# EasyEDA Pro project 1-12.eprj, schematic powermanagmen
Board Name: powermanagmen; Create Date: 2026-01-12; Page Name: powermanagmen; Project Name: 1-12; Schematic Name: powermanagmen; Update Date: 2026-01-19; File: powermanagmen; Id: /; Sheet: /
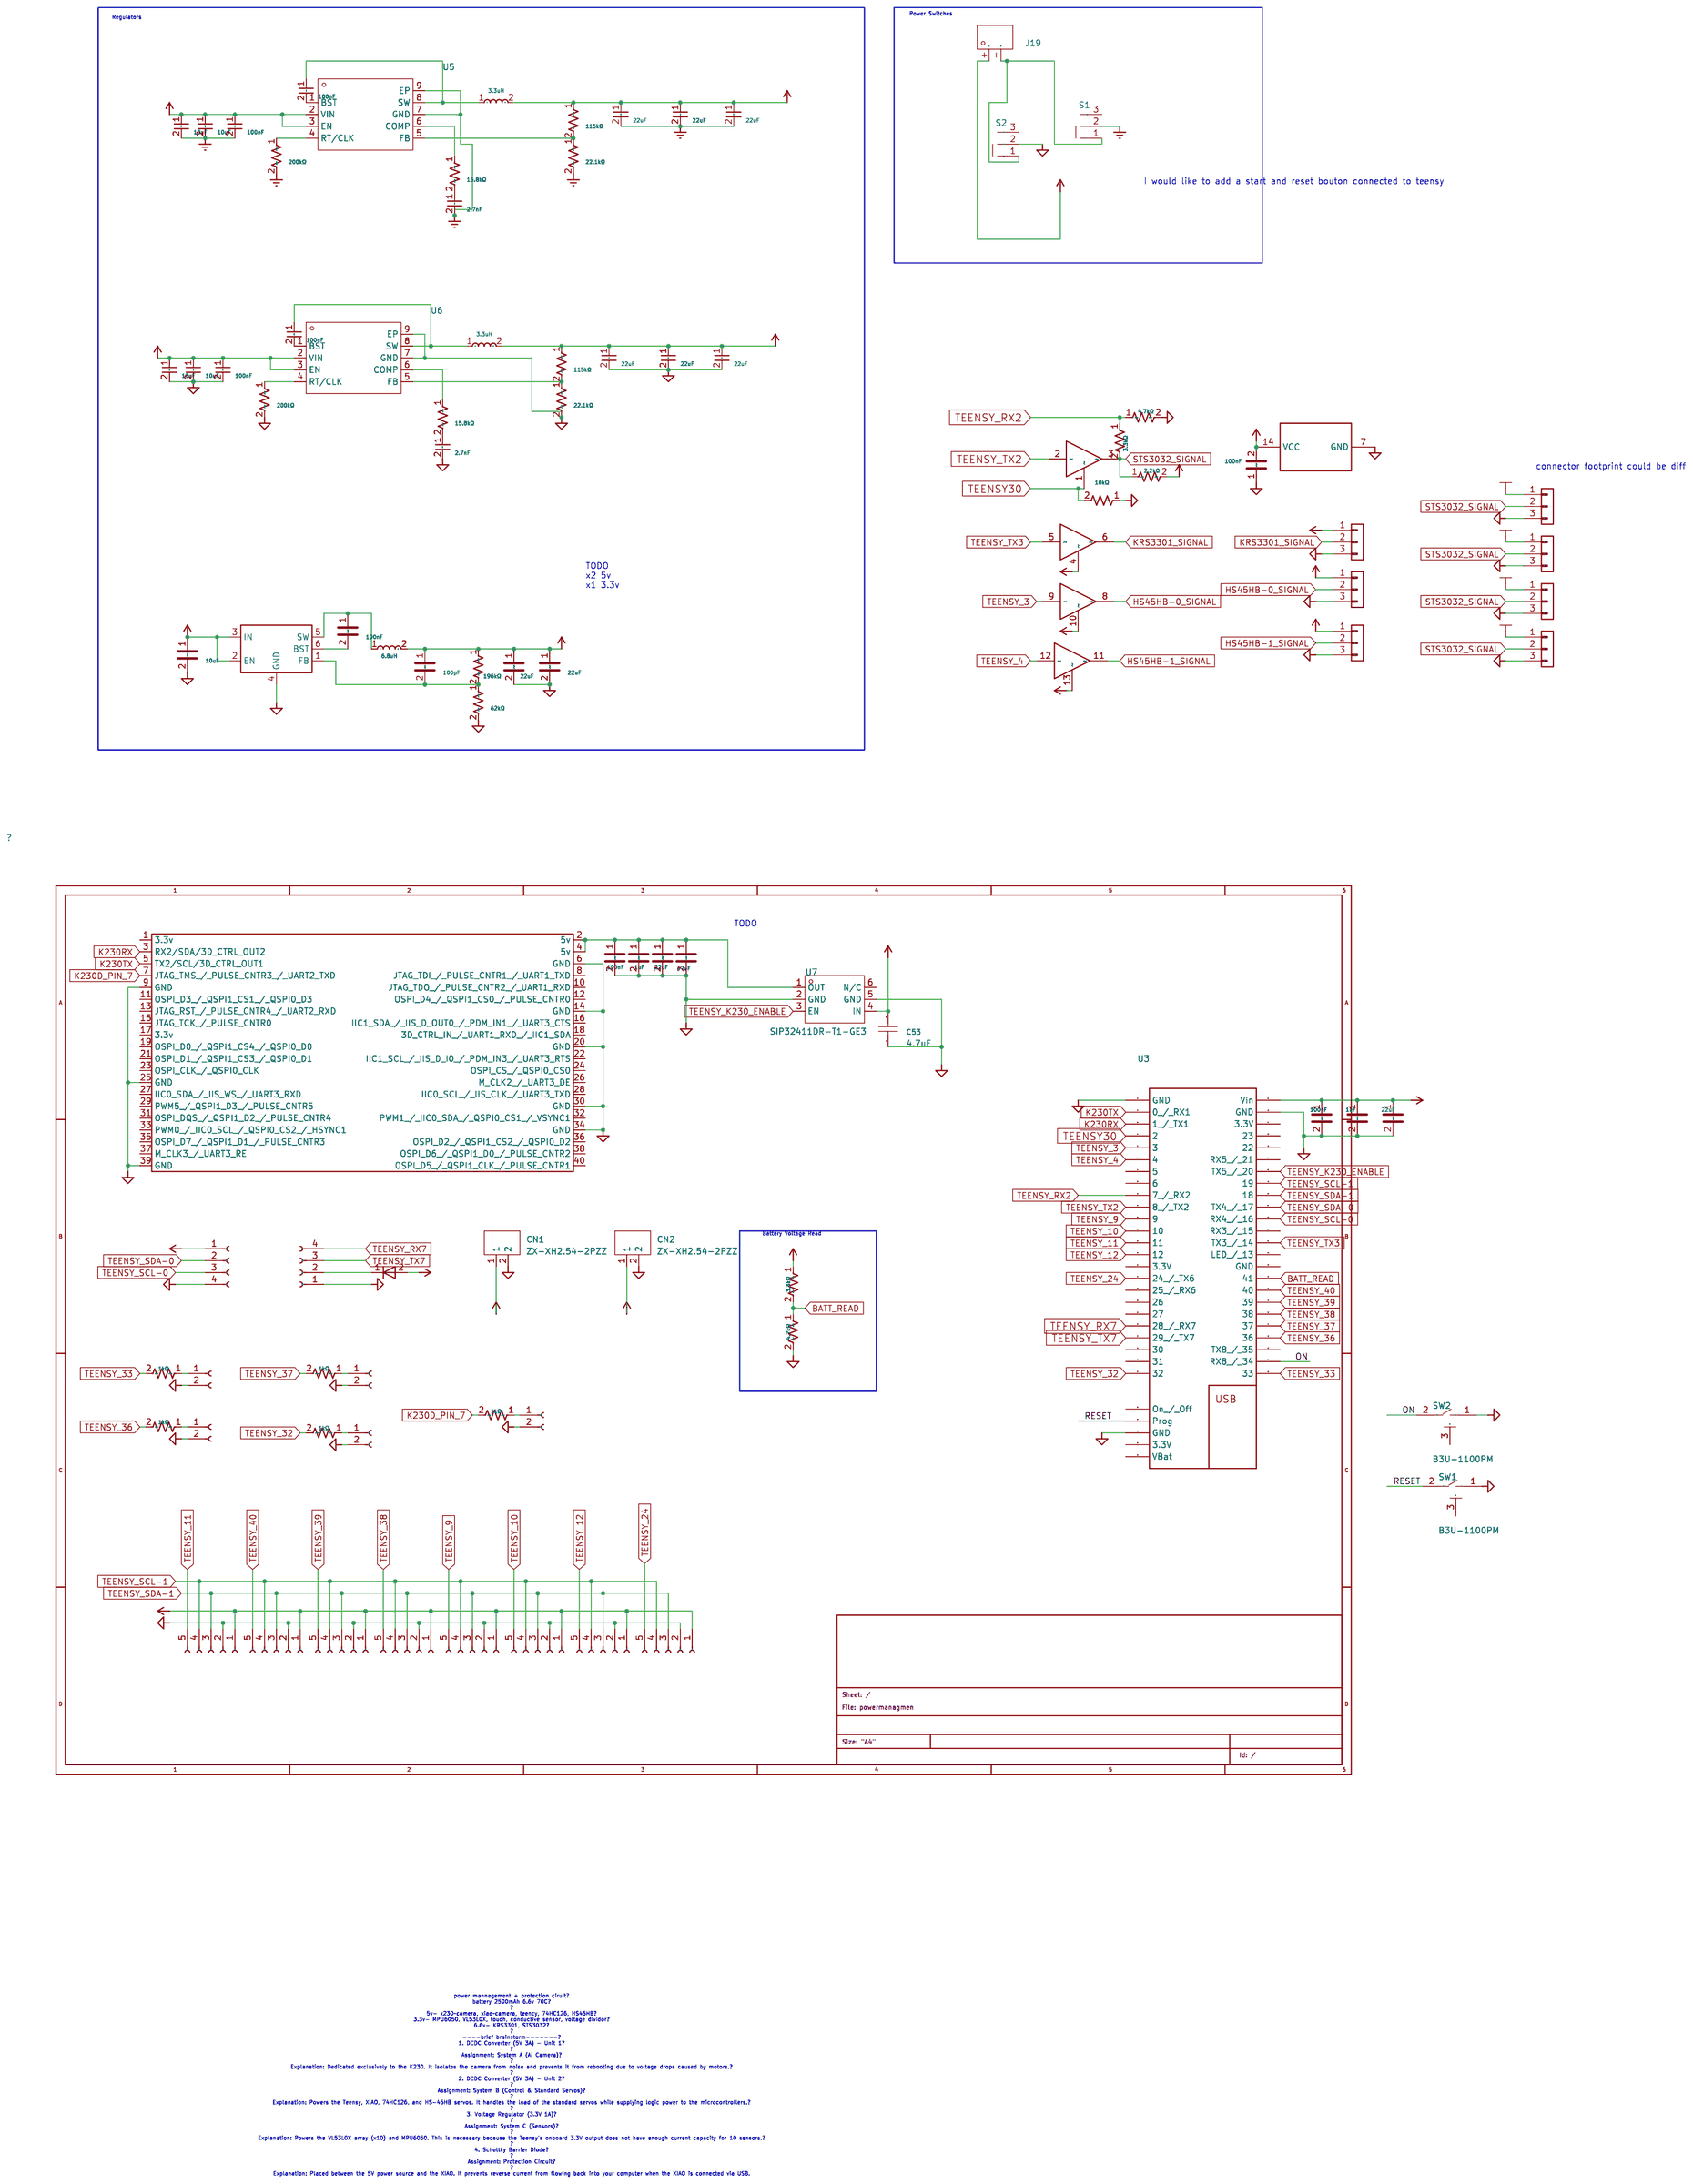
[diagram p0: schematic sheet]

## Parts
C1  100nF  [C0603]
C2  22uF  [C0603]
C3  1uF  [C0603]
C4  100nF  [C0603]
C5  10uF  [C0603]
C10  100pF  [C0603]
C17  100nF  [C0603]
C18  1uF  [C0603]
C19  22uF  [C0603]
C20  47uF  [C0603]
C21  22uF  [C0603]
C22  10uF  [C0603]
C23  100nF  [C0603]
C24  100nF  [C0603]
C29  22uF  [C0603]
C31  10uF  [C0603]
C40  100nF  [C0603]
C41  22uF  [C0603]
C42  22uF  [C0603]
C43  22uF  [C0603]
C44  2.7nF  [C0603]
C45  10uF  [C0603]
C46  10uF  [C0603]
C47  100nF  [C0603]
C48  100nF  [C0603]
C49  22uF  [C0603]
C50  22uF  [C0603]
C51  22uF  [C0603]
C52  2.7nF  [C0603]
C53  4.7uF  [C0603]
CN1  ZX-XH2.54-2PZZ  [CONN-TH_2P-P2.50_HX25003-2A]
CN2  ZX-XH2.54-2PZZ  [CONN-TH_2P-P2.50_HX25003-2A]
D3  BAT60B  [SOD-323_L1.7-W1.3-LS2.6-RD-1]
J1  B3B-XH-A(LF)(SN)  [CONN-TH_3P-P2.50_A2501WV2-3P]
J2  PZ254V-11-03P  [HDR-TH_3P-P2.54-V-M_PZ254V-11-03P]
J3  PZ254V-11-03P  [HDR-TH_3P-P2.54-V-M_PZ254V-11-03P]
J4  PZ254V-11-03P  [HDR-TH_3P-P2.54-V-M_PZ254V-11-03P]
J5  B4B-PH-K-S(LF)(SN)  [CONN-TH_B4B-PH-K-S]
J6  B2B-XH-A(LF)(SN)  [CONN-TH_B2B-XH-A-LF-SN]
J7  B2B-XH-A(LF)(SN)  [CONN-TH_B2B-XH-A-LF-SN]
J8  B2B-XH-A(LF)(SN)  [CONN-TH_B2B-XH-A-LF-SN]
J9  B2B-XH-A(LF)(SN)  [CONN-TH_B2B-XH-A-LF-SN]
J10  B2B-XH-A(LF)(SN)  [CONN-TH_B2B-XH-A-LF-SN]
J12  B3B-XH-A(LF)(SN)  [CONN-TH_3P-P2.50_A2501WV2-3P]
J13  B3B-XH-A(LF)(SN)  [CONN-TH_3P-P2.50_A2501WV2-3P]
J14  B3B-XH-A(LF)(SN)  [CONN-TH_3P-P2.50_A2501WV2-3P]
J18  B5B-PH-K-S(LF)(SN)  [CONN-TH_B5B-PH-K-S-LF-SN]
J19  XT60-F  [CONN-TH_XT60PB-F]
J25  B5B-PH-K-S(LF)(SN)  [CONN-TH_B5B-PH-K-S-LF-SN]
J26  B5B-PH-K-S(LF)(SN)  [CONN-TH_B5B-PH-K-S-LF-SN]
J27  B5B-PH-K-S(LF)(SN)  [CONN-TH_B5B-PH-K-S-LF-SN]
J28  B5B-PH-K-S(LF)(SN)  [CONN-TH_B5B-PH-K-S-LF-SN]
J29  B5B-PH-K-S(LF)(SN)  [CONN-TH_B5B-PH-K-S-LF-SN]
J32  B5B-PH-K-S(LF)(SN)  [CONN-TH_B5B-PH-K-S-LF-SN]
J33  B5B-PH-K-S(LF)(SN)  [CONN-TH_B5B-PH-K-S-LF-SN]
L3  6.8uH  [L0805]
L5  3.3uH  [IND-SMD_CYA0650-3.3UH]
L6  3.3uH  [IND-SMD_CYA0650-3.3UH]
R1  10kΩ  [R0603]
R4  1kΩ  [R0603]
R5  1kΩ  [R0603]
R6  1kΩ  [R0603]
R7  1kΩ  [R0603]
R8  1kΩ  [R0603]
R9  3.3kΩ  [R0603]
R10  4.7kΩ  [R0603]
R12  196kΩ  [R0603]
R15  62kΩ  [R0603]
R22  3.3kΩ  [R0603]
R23  4.7kΩ  [R0603]
R27  2.2kΩ  [R0603]
R28  115kΩ  [R0603]
R29  22.1kΩ  [R0603]
R30  15.8kΩ  [R0603]
R31  200kΩ  [R0603]
R32  200kΩ  [R0603]
R33  115kΩ  [R0603]
R34  22.1kΩ  [R0603]
R35  15.8kΩ  [R0603]
S1  SS-12M11G4  [SW-TH_XKB_SS-12M11XX]
S2  SS-12M11G4  [SW-TH_XKB_SS-12M11XX]
SW1  B3U-1100PM  [SW-SMD_3P-L3.0-W2.5-LS4.0]
SW2  B3U-1100PM  [SW-SMD_3P-L3.0-W2.5-LS4.0]
U1  CD74HCT126M96  [SOIC-14_L8.7-W3.9-P1.27-LS6.0-BL]  (sections 1,2,3,4,5)
U2  FH-00148  [HDR-SMD_40P-P2.54-V-F-R2-C20-S7.1-EH]
U3  TEENSY 4.1  [TEENSY 4.1]
U4  AP63201WU-7  [TSOT-23-6_L2.9-W1.6-P0.95-LS2.8-BR]
U5  AP64500SP-13  [SO-8_L4.9-W3.9-P1.27-LS6.0-BL-EP]
U6  AP64500SP-13  [SO-8_L4.9-W3.9-P1.27-LS6.0-BL-EP]
U7  SIP32411DR-T1-GE3  [SC-70-6_L2.1-W1.3-P0.65-LS2.1-BR]
XIAO  22035045  [CONN-TH_22035045]

## Library data of the parts
C1 C4 C17 C23 C24 C40 C47 C48 = TCC0603X7R104K500CT: Capacitance:100nF Tolerance:±10% Tolerance:±10% Voltage Rating:50V Temperature Coefficient:X7R; LCSC Part Name: 100nF ±10% 50V; Supplier Part: C282519; Manufacturer: CCTC(三环); Supplier Footprint: 0603; JLCPCB Part Class: Extended Part; Datasheet: https://item.szlcsc.com/datasheet/TCC0603X7R104K500CT/268639.html; Supplier: LCSC; Tolerance: ±10%; Voltage Rating: 50V; Temperature Coefficient: X7R
C2 C19 C21 C29 C41-C43 C49-C51 = CL10A226MP8NUNE: Capacitance:22uF Tolerance:±20% Tolerance:±20% Voltage Rating:10V Temperature Coefficient:X5R; LCSC Part Name: 22uF ±20% 10V; Supplier Part: C86295; Manufacturer: SAMSUNG(三星); Supplier Footprint: 0603; JLCPCB Part Class: Extended Part; Datasheet: https://item.szlcsc.com/datasheet/CL10A226MP8NUNE/87471.html; Supplier: LCSC; Tolerance: ±20%; Voltage Rating: 10V; Temperature Coefficient: X5R
C3 C18 = CL10A105KB8NNNC: Capacitance:1uF Tolerance:±10% Tolerance:±10% Voltage Rating:50V Temperature Coefficient:X5R; LCSC Part Name: 1uF ±10% 50V; Supplier Part: C15849; Manufacturer: SAMSUNG(三星); Supplier Footprint: 0603; JLCPCB Part Class: Basic Part; Datasheet: https://item.szlcsc.com/datasheet/CL10A105KB8NNNC/16531.html; Supplier: LCSC; Tolerance: ±10%; Voltage Rating: 50V; Temperature Coefficient: X5R
C5 C22 C31 C45 C46 = CL10A106MO8NQNC: Capacitance:10uF Tolerance:±20% Tolerance:±20% Voltage Rating:16V Temperature Coefficient:X5R; LCSC Part Name: 10uF ±20% 16V; Supplier Part: C92487; Manufacturer: SAMSUNG(三星); Supplier Footprint: 0603; JLCPCB Part Class: Extended Part; Datasheet: https://item.szlcsc.com/datasheet/CL10A106MO8NQNC/93680.html; Supplier: LCSC; Tolerance: ±20%; Voltage Rating: 16V; Temperature Coefficient: X5R
C10 = CL10C101JB8NNNC: Capacitance:100pF Tolerance:±5% Tolerance:±5% Voltage Rating:50V Temperature Coefficient:C0G; LCSC Part Name: 100pF ±5% 50V; Supplier Part: C14858; Manufacturer: SAMSUNG(三星); Supplier Footprint: 0603; JLCPCB Part Class: Basic Part; Datasheet: https://item.szlcsc.com/datasheet/CL10C101JB8NNNC/15530.html; Supplier: LCSC; Tolerance: ±5%; Voltage Rating: 50V; Temperature Coefficient: C0G
C20 = GRM188R60J476ME15D: Capacitance:47uF Tolerance:±20% Tolerance:±20% Voltage Rating:6.3V Temperature Coefficient:X5R; LCSC Part Name: 47uF ±20% 6.3V; Supplier Part: C140782; Manufacturer: muRata(村田); Supplier Footprint: 0603; JLCPCB Part Class: Extended Part; Datasheet: https://item.szlcsc.com/datasheet/GRM188R60J476ME15D/152108.html; Supplier: LCSC; Tolerance: ±20%; Voltage Rating: 6.3V; Temperature Coefficient: X5R
C44 C52 = GRM1885C1H272JA01D: Capacitance:2.7nF Tolerance:±5% Tolerance:±5% Voltage Rating:50V Temperature Coefficient:C0G; LCSC Part Name: 2.7nF ±5% 50V; Supplier Part: C77034; Manufacturer: muRata(村田); Supplier Footprint: 0603; JLCPCB Part Class: Extended Part; Datasheet: https://item.szlcsc.com/datasheet/GRM1885C1H272JA01D/78161.html; Supplier: LCSC; Tolerance: ±5%; Voltage Rating: 50V; Temperature Coefficient: C0G
C53 = CL10A475KP8NNNC: LCSC Part Name: 4.7uF ±10% 10V; Supplier Part: C1705; Manufacturer: SAMSUNG(三星); Supplier Footprint: 0603; JLCPCB Part Class: Extended Part; Datasheet: https://item.szlcsc.com/datasheet/CL10A475KP8NNNC/2057.html; Supplier: LCSC; Tolerance: ±10%; Voltage Rating: 10V; Temperature Coefficient: X5R
CN1 CN2 = ZX-XH2.54-2PZZ: Pins Structure:1x2P Pitch:2.5mm Mounting Type:Through Hole Reference Series:XH Number of Pins:2P Number of Rows:1 Number of PINs Per Row:2 Row Spacing:- Current Rating:2A Contact Material:Brass Contact Plating:Tin Operating Temperature:-25℃~+85℃ Operating; LCSC Part Name: 1x2P 间距:2.5mm 直插 系列:XH; Supplier Part: C7429632; Manufacturer: Megastar(兆星); Supplier Footprint: 插件,P=2.5mm; JLCPCB Part Class: Extended Part; Datasheet: https://item.szlcsc.com/datasheet/ZX-XH2.54-2PZZ/8427549.html; Supplier: LCSC; Pins Structure: 1x2P; Pitch: 2.5mm; Mounting Type: Through Hole; Reference Series: XH; Number of Pins: 2P; Number of Rows: 1; Number of PINs Per Row: 2; Current Rating: 2A; Contact Material: Brass; Contact Plating: Tin; Operating Temperature: -25℃~+85℃; Voltage Rating: 250V; Plastic Material: PA66; Flame Retardant Rating: UL94V-0; Color: White; Z-Height of the Board: 7mm; X-Length of Bottom Edge on Board (Spacing Line): 7.5mm; Y-Width of Bottom Edge on Board: 5.9mm
D3 = BAT60B_C7502695: Diode Configuration:Independent Voltage - Forward(Vf@If):600mV@1A Voltage - DC Reverse(Vr):10V Current - Rectified:3A Reverse Leakage Current (Ir):25uA Non-Repetitive Peak Forward Surge Current:5A; LCSC Part Name: 电压:10V 电流:3A; Supplier Part: C7502695; Manufacturer: R+O(宏嘉诚); Supplier Footprint: SOD-323; JLCPCB Part Class: Extended Part; Datasheet: https://item.szlcsc.com/datasheet/BAT60B/8589412.html; Supplier: LCSC; Diode Configuration: Independent; Voltage - Forward(Vf@If): 600mV@1A; Voltage - DC Reverse(Vr): 10V; Current - Rectified: 3A; Reverse Leakage Current (Ir): 25uA; Non-Repetitive Peak Forward Surge Current: 5A
J1 J12-J14 = B3B-XH-A(LF)(SN): Pins Structure:1x3P Pitch:2.5mm Mounting Type:Through Hole Reference Series:XH Number of Pins:3P Number of Rows:1 Number of PINs Per Row:3 Row Spacing:- Current Rating:3A Contact Material:Brass Contact Plating:Tin Operating Temperature:-25℃~+85℃ Operating; LCSC Part Name: 1x3P 间距:2.5mm 直插 系列:XH; Supplier Part: C144394; Manufacturer: JST; Supplier Footprint: 插件,P=2.5mm; JLCPCB Part Class: Extended Part; Datasheet: https://item.szlcsc.com/datasheet/B3B-XH-A(LF)(SN)/155726.html; Supplier: LCSC; Pins Structure: 1x3P; Pitch: 2.5mm; Mounting Type: Through Hole; Reference Series: XH; Number of Pins: 3P; Number of Rows: 1; Number of PINs Per Row: 3; Current Rating: 3A; Contact Material: Brass; Contact Plating: Tin; Operating Temperature: -25℃~+85℃; Voltage Rating: 250V; Plastic Material: PA66; Flame Retardant Rating: UL94V-0; Supplementary Features: K Pin; Color: White; Z-Height of the Board: 7mm; X-Length of Bottom Edge on Board (Spacing Line): 9.9mm; Y-Width of Bottom Edge on Board: 5.75mm
J2-J4 = PZ254V-11-03P: Pin Structure:1x3P Pitch:2.54mm Row Spacing:- Circluar Pins/Square Pins:Pin Header Mounting Type:Through Hole Number of Rows:1 Number of Pins:3P Current Rating:3A Voltage Rating (Max):250V Length of Mating Pin:6mm Insulation Height:2.5mm Length of End Con; LCSC Part Name: 1x3P 间距:2.54mm 方针 直插; Supplier Part: C2937625; Manufacturer: XFCN(兴飞); Supplier Footprint: 插件,P=2.54mm; JLCPCB Part Class: Extended Part; Datasheet: https://item.szlcsc.com/datasheet/PZ254V-11-03P/3293280.html; Supplier: LCSC; Pin Structure: 1x3P; Pitch: 2.54mm; Circluar Pins/Square Pins: Pin Header; Mounting Type: Through Hole; Number of Rows: 1; Number of Pins: 3P; Current Rating: 3A; Voltage Rating (Max): 250V; Length of Mating Pin: 6mm; Insulation Height: 2.5mm; Length of End Connection Pin: 3mm; Operating Temperature: -40℃~+105℃; Color: Black
J5 = B4B-PH-K-S(LF)(SN)_C131334: Pins Structure:1x4P Pitch:2mm Mounting Type:Through Hole Reference Series:PH Number of Pins:4P Number of Rows:1 Number of PINs Per Row:4 Row Spacing:- Current Rating:2A Contact Material:Brass Contact Plating:Tin Operating Temperature:-25℃~+85℃ Operating T; LCSC Part Name: 1x4P 间距:2mm 直插 系列:PH; Supplier Part: C131334; Manufacturer: JST; Supplier Footprint: 插件,P=2mm; JLCPCB Part Class: Extended Part; Datasheet: https://item.szlcsc.com/datasheet/B4B-PH-K-S(LF)(SN)/142627.html; Supplier: LCSC; Pins Structure: 1x4P; Pitch: 2mm; Mounting Type: Through Hole; Reference Series: PH; Number of Pins: 4P; Number of Rows: 1; Number of PINs Per Row: 4; Current Rating: 2A; Contact Material: Brass; Contact Plating: Tin; Operating Temperature: -25℃~+85℃; Voltage Rating: 100V; Plastic Material: PA66; Flame Retardant Rating: UL94V-0; Supplementary Features: K Pin; Color: White; Z-Height of the Board: 6mm; X-Length of Bottom Edge on Board (Spacing Line): 9.9mm; Y-Width of Bottom Edge on Board: 4.5mm
J6-J10 = B2B-XH-A(LF)(SN): Pins Structure:1x2P Pitch:2.5mm Mounting Type:Through Hole Reference Series:XH Number of Pins:2P Number of Rows:1 Number of PINs Per Row:2 Row Spacing:- Current Rating:3A Contact Material:Brass Contact Plating:Tin Operating Temperature:-25℃~+85℃ Operating; LCSC Part Name: 1x2P 间距:2.5mm 直插 系列:XH; Supplier Part: C158012; Manufacturer: JST; Supplier Footprint: 插件,P=2.5mm; JLCPCB Part Class: Extended Part; Datasheet: https://item.szlcsc.com/datasheet/B2B-XH-A(LF)(SN)/169360.html; Supplier: LCSC; Pins Structure: 1x2P; Pitch: 2.5mm; Mounting Type: Through Hole; Reference Series: XH; Number of Pins: 2P; Number of Rows: 1; Number of PINs Per Row: 2; Current Rating: 3A; Contact Material: Brass; Contact Plating: Tin; Operating Temperature: -25℃~+85℃; Voltage Rating: 250V; Plastic Material: PA66; Flame Retardant Rating: UL94V-0; Supplementary Features: K Pin; Color: White; Z-Height of the Board: 7mm; X-Length of Bottom Edge on Board (Spacing Line): 7.4mm; Y-Width of Bottom Edge on Board: 5.75mm
J18 J25-J29 J32 J33 = B5B-PH-K-S(LF)(SN): Pins Structure:1x5P Pitch:2mm Mounting Type:Through Hole Reference Series:PH Number of Pins:5P Number of Rows:1 Number of PINs Per Row:5 Row Spacing:- Current Rating:2A Contact Material:Brass Contact Plating:Tin Operating Temperature:-25℃~+85℃ Operating T; LCSC Part Name: 1x5P 间距:2mm 直插 系列:PH; Supplier Part: C157993; Manufacturer: JST; Supplier Footprint: 插件,P=2mm; JLCPCB Part Class: Extended Part; Datasheet: https://item.szlcsc.com/datasheet/B5B-PH-K-S(LF)(SN)/169341.html; Supplier: LCSC; Pins Structure: 1x5P; Pitch: 2mm; Mounting Type: Through Hole; Reference Series: PH; Number of Pins: 5P; Number of Rows: 1; Number of PINs Per Row: 5; Current Rating: 2A; Contact Material: Brass; Contact Plating: Tin; Operating Temperature: -25℃~+85℃; Voltage Rating: 100V; Plastic Material: PA66; Flame Retardant Rating: UL94V-0; Supplementary Features: K Pin; Color: White; Z-Height of the Board: 6mm; X-Length of Bottom Edge on Board (Spacing Line): 11.9mm; Y-Width of Bottom Edge on Board: 4.5mm
J19 = XT60-F: Power:- Output:- Input:- Size:- Interface:- Type:- Colour:Yellow MaximumCurrent:- Type:Banana Connector RatedVoltage:- Type1:- NumberOfUSBHoles:- InterfaceType:Female MetalMaterial:Gold Plated InsulationMaterial:- RatedCurrent:- RecommendedWireGauge:- Fla; LCSC Part Name: AMASS(艾迈斯)XT60模型插头 3.5mm镀金香蕉头母头 XT60-F; Supplier Part: C98734; Manufacturer: AMASS(艾迈斯); JLCPCB Part Class: Extended Part; Datasheet: https://item.szlcsc.com/datasheet/XT60-F/99944.html; Supplier: LCSC; Type: Banana Connector; Colour: Yellow; InterfaceType: Female; MetalMaterial: Gold Plated
L3 = MGFL2012F6R8MT-LF: Inductance:6.8uH Tolerance:±20% Tolerance:±20% Current Rating:550mA Current - Saturation (Isat):- DC Resistance(DCR):270mΩ Q @ Frequency:- Frequency - Self Resonant:- Ratings:-; LCSC Part Name: 6.8uH ±20%; Supplier Part: C486332; Manufacturer: microgate(麦捷科技); Supplier Footprint: 0805; JLCPCB Part Class: Extended Part; Datasheet: https://item.szlcsc.com/datasheet/MGFL2012F6R8MT-LF/494805.html; Supplier: LCSC; Tolerance: ±20%; Current Rating: 550mA; DC Resistance(DCR): 270mΩ
L5 L6 = CYA0650-3.3UH: Inductance: Tolerance:±20% Tolerance:±20% Current Rating: DC Resistance(DCR):19.9mΩ; LCSC Part Name: 3.3uH ±20%; Supplier Part: C5189753; Manufacturer: SHOU HAN(首韩); Supplier Footprint: SMD,7.2x6.6mm; JLCPCB Part Class: Extended Part; Datasheet: https://atta.szlcsc.com/upload/public/pdf/source/20250110/D8E5DDB17316764D39629F3242DE5FE2.pdf; Supplier: LCSC; Tolerance: ±20%; DC Resistance(DCR): 19.9mΩ
R1 = 0603WAF1002T5E: Type:Thick Film Resistor Resistance:10kΩ Tolerance:±1% Tolerance:±1% Power(Watts):100mW Voltage-Supply(Max):75V Temperature Coefficient:±100ppm/℃ Temperature Coefficient:±100ppm/℃ Operating Temperature:-55℃~+155℃ Operating Temperature:-55℃~+155℃; LCSC Part Name: 厚膜电阻 10kΩ ±1% 100mW; Supplier Part: C25804; Manufacturer: UNI-ROYAL(厚声); Supplier Footprint: 0603; JLCPCB Part Class: Basic Part; Datasheet: https://item.szlcsc.com/datasheet/0603WAF1002T5E/26547.html; Supplier: LCSC; Type: Thick Film Resistor; Tolerance: ±1%; Power(Watts): 100mW; Voltage-Supply(Max): 75V; Temperature Coefficient: ±100ppm/℃; Operating Temperature: -55℃~+155℃
R4-R7 = 0603WAF4700T5E: Type:Thick Film Resistor Resistance:470Ω Tolerance:±1% Tolerance:±1% Power(Watts):100mW Voltage-Supply(Max):75V Temperature Coefficient:±100ppm/℃ Temperature Coefficient:±100ppm/℃ Operating Temperature:-55℃~+155℃ Operating Temperature:-55℃~+155℃; LCSC Part Name: 470Ω ±1% 100mW 厚膜电阻; Supplier Part: C23179; Manufacturer: UNI-ROYAL(厚声); Supplier Footprint: 0603; JLCPCB Part Class: Basic Part; Datasheet: https://item.szlcsc.com/datasheet/0603WAF4700T5E/23906.html; Supplier: LCSC; Type: Thick Film Resistor; Tolerance: ±1%; Power(Watts): 100mW; Voltage-Supply(Max): 75V; Temperature Coefficient: ±100ppm/℃; Operating Temperature: -55℃~+155℃
R8 = 0603WAF1001T5E: Type:Thick Film Resistor Resistance:1kΩ Tolerance:±1% Tolerance:±1% Power(Watts):100mW Voltage-Supply(Max):75V Temperature Coefficient:±100ppm/℃ Temperature Coefficient:±100ppm/℃ Operating Temperature:-55℃~+155℃ Operating Temperature:-55℃~+155℃; LCSC Part Name: 1kΩ ±1% 100mW 厚膜电阻; Supplier Part: C21190; Manufacturer: UNI-ROYAL(厚声); Supplier Footprint: 0603; JLCPCB Part Class: Basic Part; Datasheet: https://item.szlcsc.com/datasheet/0603WAF1001T5E/21904.html; Supplier: LCSC; Type: Thick Film Resistor; Tolerance: ±1%; Power(Watts): 100mW; Voltage-Supply(Max): 75V; Temperature Coefficient: ±100ppm/℃; Operating Temperature: -55℃~+155℃
R9 R10 R27 = 0603WAF2201T5E_C4190: Type:Thick Film Resistors Resistance:2.2kΩ Tolerance:±1% Tolerance:±1% Power(Watts): Overload Voltage (Max): Temperature Coefficient:±100ppm/℃ Temperature Coefficient:±100ppm/℃ Operating Temperature Range:-55℃~+155℃ Operating Temperature Range:-55℃~+155℃; LCSC Part Name: 2.2kΩ ±1% 100mW 厚膜电阻; Supplier Part: C4190; Manufacturer: UNI-ROYAL(厚声); Manufacturer Part: 0603WAF2201T5E; Supplier Footprint: 0603; JLCPCB Part Class: Basic Part; Datasheet: https://atta.szlcsc.com/upload/public/pdf/source/20200306/C422600_1E6D84923E4A46A82E41ADD87F860B5C.pdf; Supplier: LCSC; Type: Thick Film Resistors; Tolerance: ±1%; Temperature Coefficient: ±100ppm/℃; Operating Temperature Range: -55℃~+155℃
R12 = FRC0603F1963TS: Type:Thick Film Resistor Resistance:196kΩ Tolerance:±1% Tolerance:±1% Power(Watts):100mW Voltage-Supply(Max):75V Temperature Coefficient:±100ppm/℃ Temperature Coefficient:±100ppm/℃ Operating Temperature:-55℃~+155℃ Operating Temperature:-55℃~+155℃; LCSC Part Name: 196kΩ ±1% 100mW 厚膜电阻; Supplier Part: C2974032; Manufacturer: FOJAN(富捷); Supplier Footprint: 0603; JLCPCB Part Class: Extended Part; Supplier: LCSC; Type: Thick Film Resistor; Tolerance: ±1%; Power(Watts): 100mW; Voltage-Supply(Max): 75V; Temperature Coefficient: ±100ppm/℃; Operating Temperature: -55℃~+155℃
R15 = FRC0603F6202TS: Type:Thick Film Resistor Resistance:62kΩ Tolerance:±1% Tolerance:±1% Power(Watts):100mW Voltage-Supply(Max):75V Temperature Coefficient:±100ppm/℃ Temperature Coefficient:±100ppm/℃ Operating Temperature:-55℃~+155℃ Operating Temperature:-55℃~+155℃; LCSC Part Name: 62kΩ ±1% 100mW 厚膜电阻; Supplier Part: C2907059; Manufacturer: FOJAN(富捷); Supplier Footprint: 0603; JLCPCB Part Class: Extended Part; Supplier: LCSC; Type: Thick Film Resistor; Tolerance: ±1%; Power(Watts): 100mW; Voltage-Supply(Max): 75V; Temperature Coefficient: ±100ppm/℃; Operating Temperature: -55℃~+155℃
R22 = ARG03FTC8002N: Type:Thin Film Resistor Resistance:80kΩ Tolerance:±1% Tolerance:±1% Power(Watts):100mW Voltage-Supply(Max):75V Temperature Coefficient:±25ppm/℃ Temperature Coefficient:±25ppm/℃ Operating Temperature:-55℃~+155℃ Operating Temperature:-55℃~+155℃; LCSC Part Name: 薄膜电阻 80kΩ ±1% 100mW 停产; Supplier Part: C3014409; Manufacturer: Viking(光颉); Supplier Footprint: 0603; JLCPCB Part Class: Extended Part; Datasheet: https://item.szlcsc.com/datasheet/ARG03FTC8002N/3525166.html; Supplier: LCSC; Type: Thin Film Resistor; Tolerance: ±1%; Power(Watts): 100mW; Voltage-Supply(Max): 75V; Temperature Coefficient: ±25ppm/℃; Operating Temperature: -55℃~+155℃
R23 = FRC0603F2002TS: Type:Thick Film Resistor Resistance:20kΩ Tolerance:±1% Tolerance:±1% Power(Watts):100mW Voltage-Supply(Max):75V Temperature Coefficient:±100ppm/℃ Temperature Coefficient:±100ppm/℃ Operating Temperature:-55℃~+155℃ Operating Temperature:-55℃~+155℃; LCSC Part Name: 20kΩ ±1% 100mW 厚膜电阻; Supplier Part: C2907011; Manufacturer: FOJAN(富捷); Supplier Footprint: 0603; JLCPCB Part Class: Extended Part; Supplier: LCSC; Type: Thick Film Resistor; Tolerance: ±1%; Power(Watts): 100mW; Voltage-Supply(Max): 75V; Temperature Coefficient: ±100ppm/℃; Operating Temperature: -55℃~+155℃
R28 R33 = 0603WAF1153T5E: Type:Thick Film Resistor Resistance:115kΩ Tolerance:±1% Tolerance:±1% Power(Watts):100mW Voltage-Supply(Max):75V Temperature Coefficient:±100ppm/℃ Temperature Coefficient:±100ppm/℃ Operating Temperature:-55℃~+155℃ Operating Temperature:-55℃~+155℃; LCSC Part Name: 115kΩ ±1% 100mW 厚膜电阻; Supplier Part: C22783; Manufacturer: UNI-ROYAL(厚声); Supplier Footprint: 0603; JLCPCB Part Class: Extended Part; Datasheet: https://item.szlcsc.com/datasheet/0603WAF1153T5E/23510.html; Supplier: LCSC; Type: Thick Film Resistor; Tolerance: ±1%; Power(Watts): 100mW; Voltage-Supply(Max): 75V; Temperature Coefficient: ±100ppm/℃; Operating Temperature: -55℃~+155℃
R29 R34 = 0603WAF2212T5E: LCSC Part Name: 22.1kΩ ±1% 100mW 厚膜电阻; Supplier Part: C25961; Manufacturer: UNI-ROYAL(厚声); Supplier Footprint: 0603; JLCPCB Part Class: Extended Part; Datasheet: https://atta.szlcsc.com/upload/public/pdf/source/20200306/C422600_1E6D84923E4A46A82E41ADD87F860B5C.pdf; Supplier: LCSC; Type: Thick Film Resistors; Tolerance: ±1%; Temperature Coefficient: ±100ppm/℃; Operating Temperature Range: -55℃~+155℃
R30 R35 = FRC0603F1582TS: Type:Thick Film Resistor Resistance:15.8kΩ Tolerance:±1% Tolerance:±1% Power(Watts):100mW Voltage-Supply(Max):75V Temperature Coefficient:±100ppm/℃ Temperature Coefficient:±100ppm/℃ Operating Temperature:-55℃~+155℃ Operating Temperature:-55℃~+155℃; LCSC Part Name: 15.8kΩ ±1% 100mW 厚膜电阻; Supplier Part: C2960716; Manufacturer: FOJAN(富捷); Supplier Footprint: 0603; JLCPCB Part Class: Extended Part; Supplier: LCSC; Type: Thick Film Resistor; Tolerance: ±1%; Power(Watts): 100mW; Voltage-Supply(Max): 75V; Temperature Coefficient: ±100ppm/℃; Operating Temperature: -55℃~+155℃
R31 R32 = 0603WAF2003T5E: Type:Thick Film Resistors Resistance:200kΩ Tolerance:±1% Tolerance:±1% Power(Watts): Overload Voltage (Max): Temperature Coefficient:±100ppm/℃ Temperature Coefficient:±100ppm/℃ Operating Temperature Range:-55℃~+155℃ Operating Temperature Range:-55℃~+155℃; LCSC Part Name: 200kΩ ±1% 100mW 厚膜电阻; Supplier Part: C25811; Manufacturer: UNI-ROYAL(厚声); Supplier Footprint: 0603; JLCPCB Part Class: Basic Part; Datasheet: https://atta.szlcsc.com/upload/public/pdf/source/20200306/C422600_1E6D84923E4A46A82E41ADD87F860B5C.pdf; Supplier: LCSC; Type: Thick Film Resistors; Tolerance: ±1%; Temperature Coefficient: ±100ppm/℃; Operating Temperature Range: -55℃~+155℃
S1 S2 = SS-12M11G4: Circuit:SPDT Actuator Style:Rectangular Columnar Termination Style:PC Pin Length:13mm Width:7.2mm Switch Height:6.6mm Mounting Type:Through Hole Actuator Color:Black Current Rating:6A Voltage Rating:120V Life:10,000 Cycles Operating Temperature:-40℃~+85℃; LCSC Part Name: 柄长4mm 直插双档 滑动开关; Supplier Part: C2879840; Manufacturer: XKB Connection(中国星坤); Supplier Footprint: 插件,13x7.2mm; JLCPCB Part Class: Extended Part; Datasheet: https://item.szlcsc.com/datasheet/SS-12M11G4/3089136.html; Supplier: LCSC; Circuit: SPDT; Actuator Style: Rectangular Columnar; Termination Style: PC Pin; Length: 13mm; Width: 7.2mm; Switch Height: 6.6mm; Mounting Type: Through Hole; Actuator Color: Black; Current Rating: 6A; Voltage Rating: 120V; Life: 10,000 Cycles; Operating Temperature: -40℃~+85℃
SW1 SW2 = B3U-1100PM: Supplier Part: C6467298; Manufacturer: OMRON(欧姆龙); JLCPCB Part Class: Extended Part; Datasheet: https://item.szlcsc.com/datasheet/B3U-1100PM/7420485.html; Supplier: LCSC
U1 = CD74HCT126M96: Supplier Part: C2675949; Manufacturer: TI(德州仪器); Supplier Footprint: SOIC-14; JLCPCB Part Class: Extended Part; Datasheet: https://www.ti.com/cn/lit/gpn/cd74hct126; Supplier: LCSC; output type: Tri-State; Voltage - Supply: 4.5V~5.5V; Number of Elements: 4; Number of Bits per Element: 1; Current - Output Low(IOL): 6mA; Current - Output High(IOH): 6mA; Logic Family: 74HCT; Operating Temperature: -55℃~+125℃
U2 = FH-00148: Holes Structure:2x20P Pitch:2.54mm Row Spacing:2.54mm Circular Hole / Square Hole:Square Hole Mounting Type:Surface Mount,Vertical Number of Rows:2 Number of Positions:40P Current Rating:3A Voltage Rating (Max):- Holes Direction:Top Insulation Height:7.1m; LCSC Part Name: 间距:2.54mm 2x20P 立贴; Supplier Part: C2685092; Manufacturer: Liansheng(连盛); Supplier Footprint: SMD,P=2.54mm; JLCPCB Part Class: Extended Part; Datasheet: https://item.szlcsc.com/datasheet/FH-00148/2784366.html; Supplier: LCSC; Holes Structure: 2x20P; Pitch: 2.54mm; Row Spacing: 2.54mm; Circular Hole / Square Hole: Square Hole; Mounting Type: Surface Mount,Vertical; Number of Rows: 2; Number of Positions: 40P; Current Rating: 3A; Holes Direction: Top; Insulation Height: 7.1mm; Contact Material: Brass; Contact Plating: Gold; Operating Temperature: -40℃~+105℃
U3 = TEENSY 4.1
U4 = AP63201WU-7: Function:Buck Voltage - Supply:3.8V~32V Voltage - Supply:3.8V~32V Output Voltage:- Output Voltage:- Output Current:2A Frequency - Switching:500kHz Frequency - Switching:500kHz Operating Temperature:-40℃~+85℃ Operating Temperature:-40℃~+85℃ Synchronous Rec; LCSC Part Name: 3.8V至32V输入、2A低静态电流同步降压转换器，增强EMI抑制; Supplier Part: C2071044; Manufacturer: DIODES(美台); Supplier Footprint: TSOT-23-6; JLCPCB Part Class: Extended Part; Datasheet: https://item.szlcsc.com/datasheet/AP63201WU-7/2162627.html; Supplier: LCSC; Function: Buck; Voltage - Supply: 3.8V~32V; Output Current: 2A; Frequency - Switching: 500kHz; Operating Temperature: -40℃~+85℃; Synchronous Rectifier: Yes; Number of Outputs: 1; Topology: Buck; Quiescent Current: 22uA; Switch tube (built-in/external): Built-In; Output Type: Adjustable
U5 U6 = AP64500SP-13: LCSC Part Name: 降压型 5A 3.8V~40V; Supplier Part: C2070920; Manufacturer: DIODES(美台); Supplier Footprint: SO-8-EP; JLCPCB Part Class: Extended Part; Datasheet: https://item.szlcsc.com/datasheet/AP64500SP-13/2162503.html; Supplier: LCSC; Function: Buck; Voltage - Supply: 3.8V~40V; Output Voltage: 800mV~39V; Output Current: 5A; Frequency - Switching: 100kHz~2.2MHz; Operating Temperature: -40℃~+85℃; Synchronous Rectifier: Yes; Number of Outputs: 1; Topology: Buck; Quiescent Current: 25uA; Switch tube (built-in/external): Built-in; Output Type: Adjustable
U7 = SIP32411DR-T1-GE3: Supplier Part: C727484; Manufacturer: VISHAY(威世); Supplier Footprint: SC-70-6; JLCPCB Part Class: Extended Part; Datasheet: https://item.szlcsc.com/datasheet/SIP32411DR-T1-GE3/774730.html; Supplier: LCSC; Type: High Side Switch; Number of Channels: 1; Control Input Logic: Active Low; Maximum Continuous Current: 2A; Voltage - Supply: 1.1V~5.5V; RDS(on): 101mΩ; Operating Temperature	-: -40℃~+85℃
XIAO = 22035045: Pins Structure:1x4P Pitch:2.5mm Mounting Type:Through Hole Reference Series:Mini-SPOX(5264) Number of Pins:4P Number of Rows:1 Number of PINs Per Row:4 Row Spacing:- Current Rating:3A Contact Material:Brass Contact Plating:Tin Operating Temperature:-55℃~+; LCSC Part Name: 1x4P 间距:2.5mm 直插 系列:Mini-SPOX(5264); Supplier Part: C185198; Manufacturer: MOLEX; Supplier Footprint: 插件,P=2.5mm; JLCPCB Part Class: Extended Part; Datasheet: https://www.molex.com/content/dam/molex/molex-dot-com/products/automated/en-us/salesdrawingpdf/526/5267/022035045_sd.pdf?inline\; Supplier: LCSC; Pins Structure: 1x4P; Pitch: 2.5mm; Mounting Type: Through Hole; Reference Series: Mini-SPOX(5264); Number of Pins: 4P; Number of Rows: 1; Number of PINs Per Row: 4; Current Rating: 3A; Contact Material: Brass; Contact Plating: Tin; Operating Temperature: -55℃~+105℃; Voltage Rating: 250V; Plastic Material: PA; Flame Retardant Rating: UL94V-0; Color: White; Z-Height of the Board: 5.9mm; X-Length of Bottom Edge on Board (Spacing Line): 12.4mm; Y-Width of Bottom Edge on Board: 4.9mm

## Nets
+3.3V: C10.1 C21.1 C29.1 J5.1(Pin) J18.1(Pin) J25.1(Pin) J26.1(Pin) J27.1(Pin) J28.1(Pin) J29.1(Pin) J32.1(Pin) J33.1(Pin) L3.2 R12.1
+5V: C1.2 C2.1 C3.1 C4.1 C49.1 C50.1 C51.1 C53.2 D3.2(A) J2.1(Pin) J3.1(Pin) J4.1(Pin) L6.2 R27.2 R33.1 U1.4 U1.10 U1.13 U1.14(VCC) U3.25(Vin) U7.4(IN)
+5VM: C41.1 C42.1 C43.1 J1.1(Pin) J12.1(Pin) J13.1(Pin) J14.1(Pin) L5.2 R28.1
+BATT: C5.1 C22.1 C24.1 C31.1 C45.1 C46.1 C47.1 CN1.1 CN2.1 J19.+(1) R22.1 U4.2(EN) U4.3(IN) U5.2(VIN) U5.3(EN) U6.2(VIN) U6.3(EN)
BATT_READ: R22.2 R23.1 U3.40(41)
HS45HB-0_SIGNAL: J3.2(Pin) U1.8
HS45HB-1_SIGNAL: J4.2(Pin) U1.11
K230D_PIN_7: R8.2 U2.7(JTAG_TMS_/_PULSE_CNTR3_/_UART2_TXD)
K230RX: U2.3(RX2/SDA/3D_CTRL_OUT2) U3.3(1 / TX1)
K230TX: U2.5(TX2/SCL/3D_CTRL_OUT1) U3.2(0 / RX1)
KRS3301_SIGNAL: J2.2(Pin) U1.6
MGND: C5.2 C22.2 C24.2 C41.2 C42.2 C43.2 C44.2 R29.2 R31.2 S1.2 U5.7(GND) U5.9(EP)
ON: SW2.2 U3.47(RX8 / 34)
POWER_GND: C1.1 C2.2 C3.2 C4.2 C17.2 C18.2 C19.2 C20.2 C21.2 C29.2 C31.2 C45.2 C46.2 C47.2 C49.2 C50.2 C51.2 C52.2 C53.1 CN1.2 CN2.2 J1.3(Pin) J2.3(Pin) J3.3(Pin) J4.3(Pin) J5.4(Pin) J6.2(Pin) J7.2(Pin) J8.2(Pin) J9.2(Pin) J10.2(Pin) J12.3(Pin) J13.3(Pin) J14.3(Pin) J18.2(Pin) J25.2(Pin) J26.2(Pin) J27.2(Pin) J28.2(Pin) J29.2(Pin) J32.2(Pin) J33.2(Pin) R1.1 R10.2 R15.2 R23.2 R32.2 R34.2 S2.2 SW1.1 SW2.1 U1.7(GND) U2.6(GND) U2.9(GND) U2.14(GND) U2.20(GND) U2.25(GND) U2.30(GND) U2.34(GND) U2.39(GND) U3.1(GND) U3.26(GND) U3.51(GND) U4.4(GND) U6.7(GND) U6.9(EP) U7.2(GND) U7.5(GND) XIAO.1(Pin)
RESET: SW1.2 U3.50(Prog)
STS3032_SIGNAL: J1.2(Pin) J12.2(Pin) J13.2(Pin) J14.2(Pin) R9.2 R27.1 U1.3
TEENSY30: R1.2 U1.1 U3.4(2)
TEENSY_3: U1.9 U3.5(3)
TEENSY_4: U1.12 U3.6(4)
TEENSY_9: J28.5(Pin) U3.11(9)
TEENSY_10: J29.5(Pin) U3.12(10)
TEENSY_11: J25.5(Pin) U3.13(11)
TEENSY_12: J32.5(Pin) U3.14(12)
TEENSY_24: J33.5(Pin) U3.16(24 / TX6)
TEENSY_32: R7.2 U3.24(32)
TEENSY_33: R4.2 U3.48(33)
TEENSY_36: R5.2 U3.45(36)
TEENSY_37: R6.2 U3.44(37)
TEENSY_38: J27.5(Pin) U3.43(38)
TEENSY_39: J26.5(Pin) U3.42(39)
TEENSY_40: J18.5(Pin) U3.41(40)
TEENSY_K230_ENABLE: U3.31(TX5 / 20) U7.3(EN)
TEENSY_RX2: R9.1 R10.1 U3.9(7 / RX2)
TEENSY_RX7: U3.20(28 / RX7) XIAO.4(Pin)
TEENSY_SCL-0: J5.3(Pin) U3.35(RX4 / 16)
TEENSY_SCL-1: J18.4(Pin) J25.4(Pin) J26.4(Pin) J27.4(Pin) J28.4(Pin) J29.4(Pin) J32.4(Pin) J33.4(Pin) U3.32(19)
TEENSY_SDA-0: J5.2(Pin) U3.34(TX4 / 17)
TEENSY_SDA-1: J18.3(Pin) J25.3(Pin) J26.3(Pin) J27.3(Pin) J28.3(Pin) J29.3(Pin) J32.3(Pin) J33.3(Pin) U3.33(18)
TEENSY_TX2: U1.2 U3.10(8 / TX2)
TEENSY_TX3: U1.5 U3.37(TX3 / 14)
TEENSY_TX7: U3.21(29 / TX7) XIAO.3(Pin)
$1N12: C10.2 R12.2 R15.1 U4.1(FB)
$1N29: C23.1 L3.1 U4.5(SW)
$1N113: C23.2 U4.6(BST)
$1N133: J19.-(2) S1.1 S2.1
$1N12541: C17.1 C18.1 C19.1 C20.1 U2.2(5v) U2.4(5v) U7.1(OUT)
$1N12598: J10.1(Pin) R8.1
$1N12604: J8.1(Pin) R6.1
$1N12618: J6.1(Pin) R4.1
$1N12632: J9.1(Pin) R7.1
$1N12638: J7.1(Pin) R5.1
$1N35510: C40.2 U5.1(BST)
$1N35520: C40.1 L5.1 U5.8(SW)
$1N35575: R28.2 R29.1 U5.5(FB)
$1N35837: R30.1 U5.6(COMP)
$1N35914: C44.1 R30.2
$1N35993: R31.1 U5.4(RT/CLK)
$1N36774: C48.2 U6.1(BST)
$1N36776: C48.1 L6.1 U6.8(SW)
$1N36782: R33.2 R34.1 U6.5(FB)
$1N36795: R35.1 U6.6(COMP)
$1N36798: C52.1 R35.2
$1N36802: R32.1 U6.4(RT/CLK)
Net-(D3-1): D3.1(K) XIAO.2(Pin)

Not connected (* = marked no-connect by the designer): S1 3; S2 3; SW1 3; SW2 3; U2 1(3.3v) 8(JTAG_TDI_/_PULSE_CNTR1_/_UART1_TXD) 10(JTAG_TDO_/_PULSE_CNTR2_/_UART1_RXD) 11(OSPI_D3_/_QSPI1_CS1_/_QSPI0_D3) 12(OSPI_D4_/_QSPI1_CS0_/_PULSE_CNTR0) 13(JTAG_RST_/_PULSE_CNTR4_/_UART2_RXD) 15(JTAG_TCK_/_PULSE_CNTR0) 16(IIC1_SDA_/_IIS_D_OUT0_/_PDM_IN1_/_UART3_CTS) 17(3.3v) 18(3D_CTRL_IN_/_UART1_RXD_/_IIC1_SDA) 19(OSPI_D0_/_QSPI1_CS4_/_QSPI0_D0) 21(OSPI_D1_/_QSPI1_CS3_/_QSPI0_D1) 22(IIC1_SCL_/_IIS_D_I0_/_PDM_IN3_/_UART3_RTS) 23(OSPI_CLK_/_QSPI0_CLK) 24(OSPI_CS_/_QSPI0_CS0) 26(M_CLK2_/_UART3_DE) 27(IIC0_SDA_/_IIS_WS_/_UART3_RXD) 28(IIC0_SCL_/_IIS_CLK_/_UART3_TXD) 29(PWM5_/_QSPI1_D3_/_PULSE_CNTR5) 31(OSPI_DQS_/_QSPI1_D2_/_PULSE_CNTR4) 32(PWM1_/_IIC0_SDA_/_QSPI0_CS1_/_VSYNC1) 33(PWM0_/_IIC0_SCL_/_QSPI0_CS2_/_HSYNC1) 35(OSPI_D7_/_QSPI1_D1_/_PULSE_CNTR3) 36(OSPI_D2_/_QSPI1_CS2_/_QSPI0_D2) 37(M_CLK3_/_UART3_RE) 38(OSPI_D6_/_QSPI1_D0_/_PULSE_CNTR2) 40(OSPI_D5_/_QSPI1_CLK_/_PULSE_CNTR1); U3 7(5) 8(6) 15(3.3V) 17(25 / RX6) 18(26) 19(27) 22(30) 23(31) 27(3.3V) 28(23) 29(22) 30(RX5 / 21) 36(RX3 / 15) 38(LED / 13) 39(GND) 46(TX8 / 35) 49(On / Off) 52(3.3V) 53(VBat); U7 6(N/C)

## Notes on the sheet
- Regulators
- Power Switches
- I would like to add a start and reset bouton connected to teensy
- connector footprint could be diff
- TODO
  x2 5v
  x1 3.3v
- TODO
- Battery Voltage Read
- power mannagement + protection ciruit
  battery 2500mAh 6.6v 70C
  5v- k230~camera, xiao~camera, teency, 74HC126, HS45HB
  3.3v- MPU6050, VL53L0X, touch, conductive sensor, voltage dividor
  6.6v- KRS3301, STS3032
  ----brief brainstorm-------
  1. DCDC Converter (5V 3A) - Unit 1
  Assignment: System A (AI Camera)
  Explanation: Dedicated exclusively to the K230. It isolates the camera from noise and prevents it from rebooting due to voltage drops caused by motors.
  2. DCDC Converter (5V 3A) - Unit 2
  Assignment: System B (Control & Standard Servos)
  Explanation: Powers the Teensy, XIAO, 74HC126, and HS-45HB servos. It handles the load of the standard servos while supplying logic power to the microcontrollers.
  3. Voltage Regulator (3.3V 1A)
  Assignment: System C (Sensors)
  Explanation: Powers the VL53L0X array (x10) and MPU6050. This is necessary because the Teensy's onboard 3.3V output does not have enough current capacity for 10 sensors.
  4. Schottky Barrier Diode
  Assignment: Protection Circuit
  Explanation: Placed between the 5V power source and the XIAO. It prevents reverse current from flowing back into your computer when the XIAO is connected via USB.
